# Altium schematic sheet Sheet.SchDoc
size A4
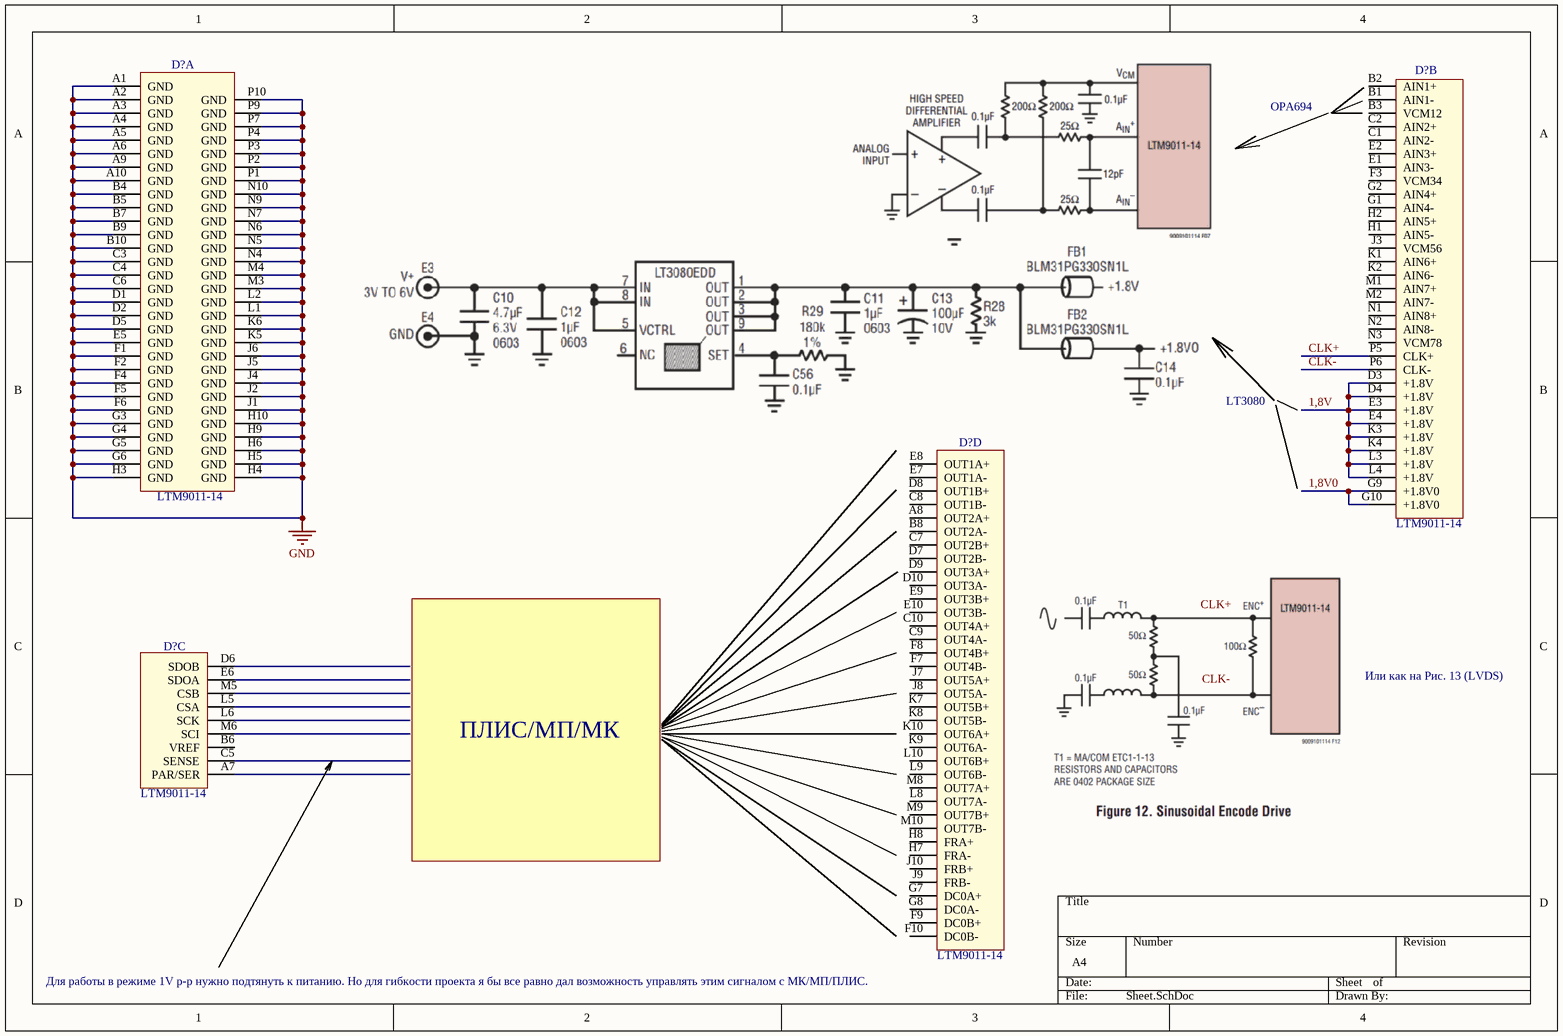
[diagram p0: Sheet.SchDoc]

## Parts
(Parts that share a designator on the sheet are numbered #1, #2 ... from top to bottom, then left to right.)
D?#1  LTM9011-14  (part A of 4)
D?#2  LTM9011-14  (part B of 4)
D?#3  LTM9011-14  (part C of 4)
D?#4  LTM9011-14  (part D of 4)

## Nets
GND: D?#1.A1(GND) D?#1.A2(GND) D?#1.A3(GND) D?#1.A4(GND) D?#1.A5(GND) D?#1.A6(GND) D?#1.A9(GND) D?#1.A10(GND) D?#1.B4(GND) D?#1.B5(GND) D?#1.B7(GND) D?#1.B9(GND) D?#1.B10(GND) D?#1.C3(GND) D?#1.C4(GND) D?#1.C6(GND) D?#1.D1(GND) D?#1.D2(GND) D?#1.D5(GND) D?#1.E5(GND) D?#1.F1(GND) D?#1.F2(GND) D?#1.F4(GND) D?#1.F5(GND) D?#1.F6(GND) D?#1.G3(GND) D?#1.G4(GND) D?#1.G5(GND) D?#1.G6(GND) D?#1.H3(GND) D?#1.H4(GND) D?#1.H5(GND) D?#1.H6(GND) D?#1.H9(GND) D?#1.H10(GND) D?#1.J1(GND) D?#1.J2(GND) D?#1.J4(GND) D?#1.J5(GND) D?#1.J6(GND) D?#1.K5(GND) D?#1.K6(GND) D?#1.L1(GND) D?#1.L2(GND) D?#1.M3(GND) D?#1.M4(GND) D?#1.N4(GND) D?#1.N5(GND) D?#1.N6(GND) D?#1.N7(GND) D?#1.N9(GND) D?#1.N10(GND) D?#1.P1(GND) D?#1.P2(GND) D?#1.P3(GND) D?#1.P4(GND) D?#1.P7(GND) D?#1.P9(GND) D?#1.P10(GND)
1,8V: D?#2.D3(+1.8V) D?#2.D4(+1.8V) D?#2.E3(+1.8V) D?#2.E4(+1.8V) D?#2.K3(+1.8V) D?#2.K4(+1.8V) D?#2.L3(+1.8V) D?#2.L4(+1.8V)
1,8V0: D?#2.G9(+1.8V0) D?#2.G10(+1.8V0)
CLK+: D?#2.P5(CLK+)
CLK-: D?#2.P6(CLK-)

Not connected (* = marked no-connect by the designer): D?#2 B1(AIN1-) B2(AIN1+) B3(VCM12) C1(AIN2-) C2(AIN2+) E1(AIN3-) E2(AIN3+) F3(VCM34) G1(AIN4-) G2(AIN4+) H1(AIN5-) H2(AIN5+) J3(VCM56) K1(AIN6+) K2(AIN6-) M1(AIN7+) M2(AIN7-) N1(AIN8+) N2(AIN8-) N3(VCM78); D?#3 A7(PAR/SER) B6(VREF) C5(SENSE) D6(SDOB) E6(SDOA) L5(CSA) L6(SCK) M5(CSB) M6(SCI); D?#4 A8(OUT2A+) B8(OUT2A-) C7(OUT2B+) C8(OUT1B-) C9(OUT4A-) C10(OUT4A+) D7(OUT2B-) D8(OUT1B+) D9(OUT3A+) D10(OUT3A-) E7(OUT1A-) E8(OUT1A+) E9(OUT3B+) E10(OUT3B-) F7(OUT4B-) F8(OUT4B+) F9(DC0B+) F10(DC0B-) G7(DC0A+) G8(DC0A-) H7(FRA-) H8(FRA+) J7(OUT5A+) J8(OUT5A-) J9(FRB-) J10(FRB+) K7(OUT5B+) K8(OUT5B-) K9(OUT6A-) K10(OUT6A+) L8(OUT7A-) L9(OUT6B-) L10(OUT6B+) M8(OUT7A+) M9(OUT7B+) M10(OUT7B-)

## Notes on the sheet
- OPA694
- LT3080
- Или как на Рис. 13 (LVDS)
- ПЛИС/МП/МК
- (near D?#4) Для работы в режиме 1V p-p нужно подтянуть к питанию. Но для гибкости проекта я бы все равно дал возможность управлять этим сигналом с МК/МП/ПЛИС.
- Labels drawn without touching a wire or pin: CLK+, CLK-